# EAGLE schematic panelize (EAGLE 9.5.1)
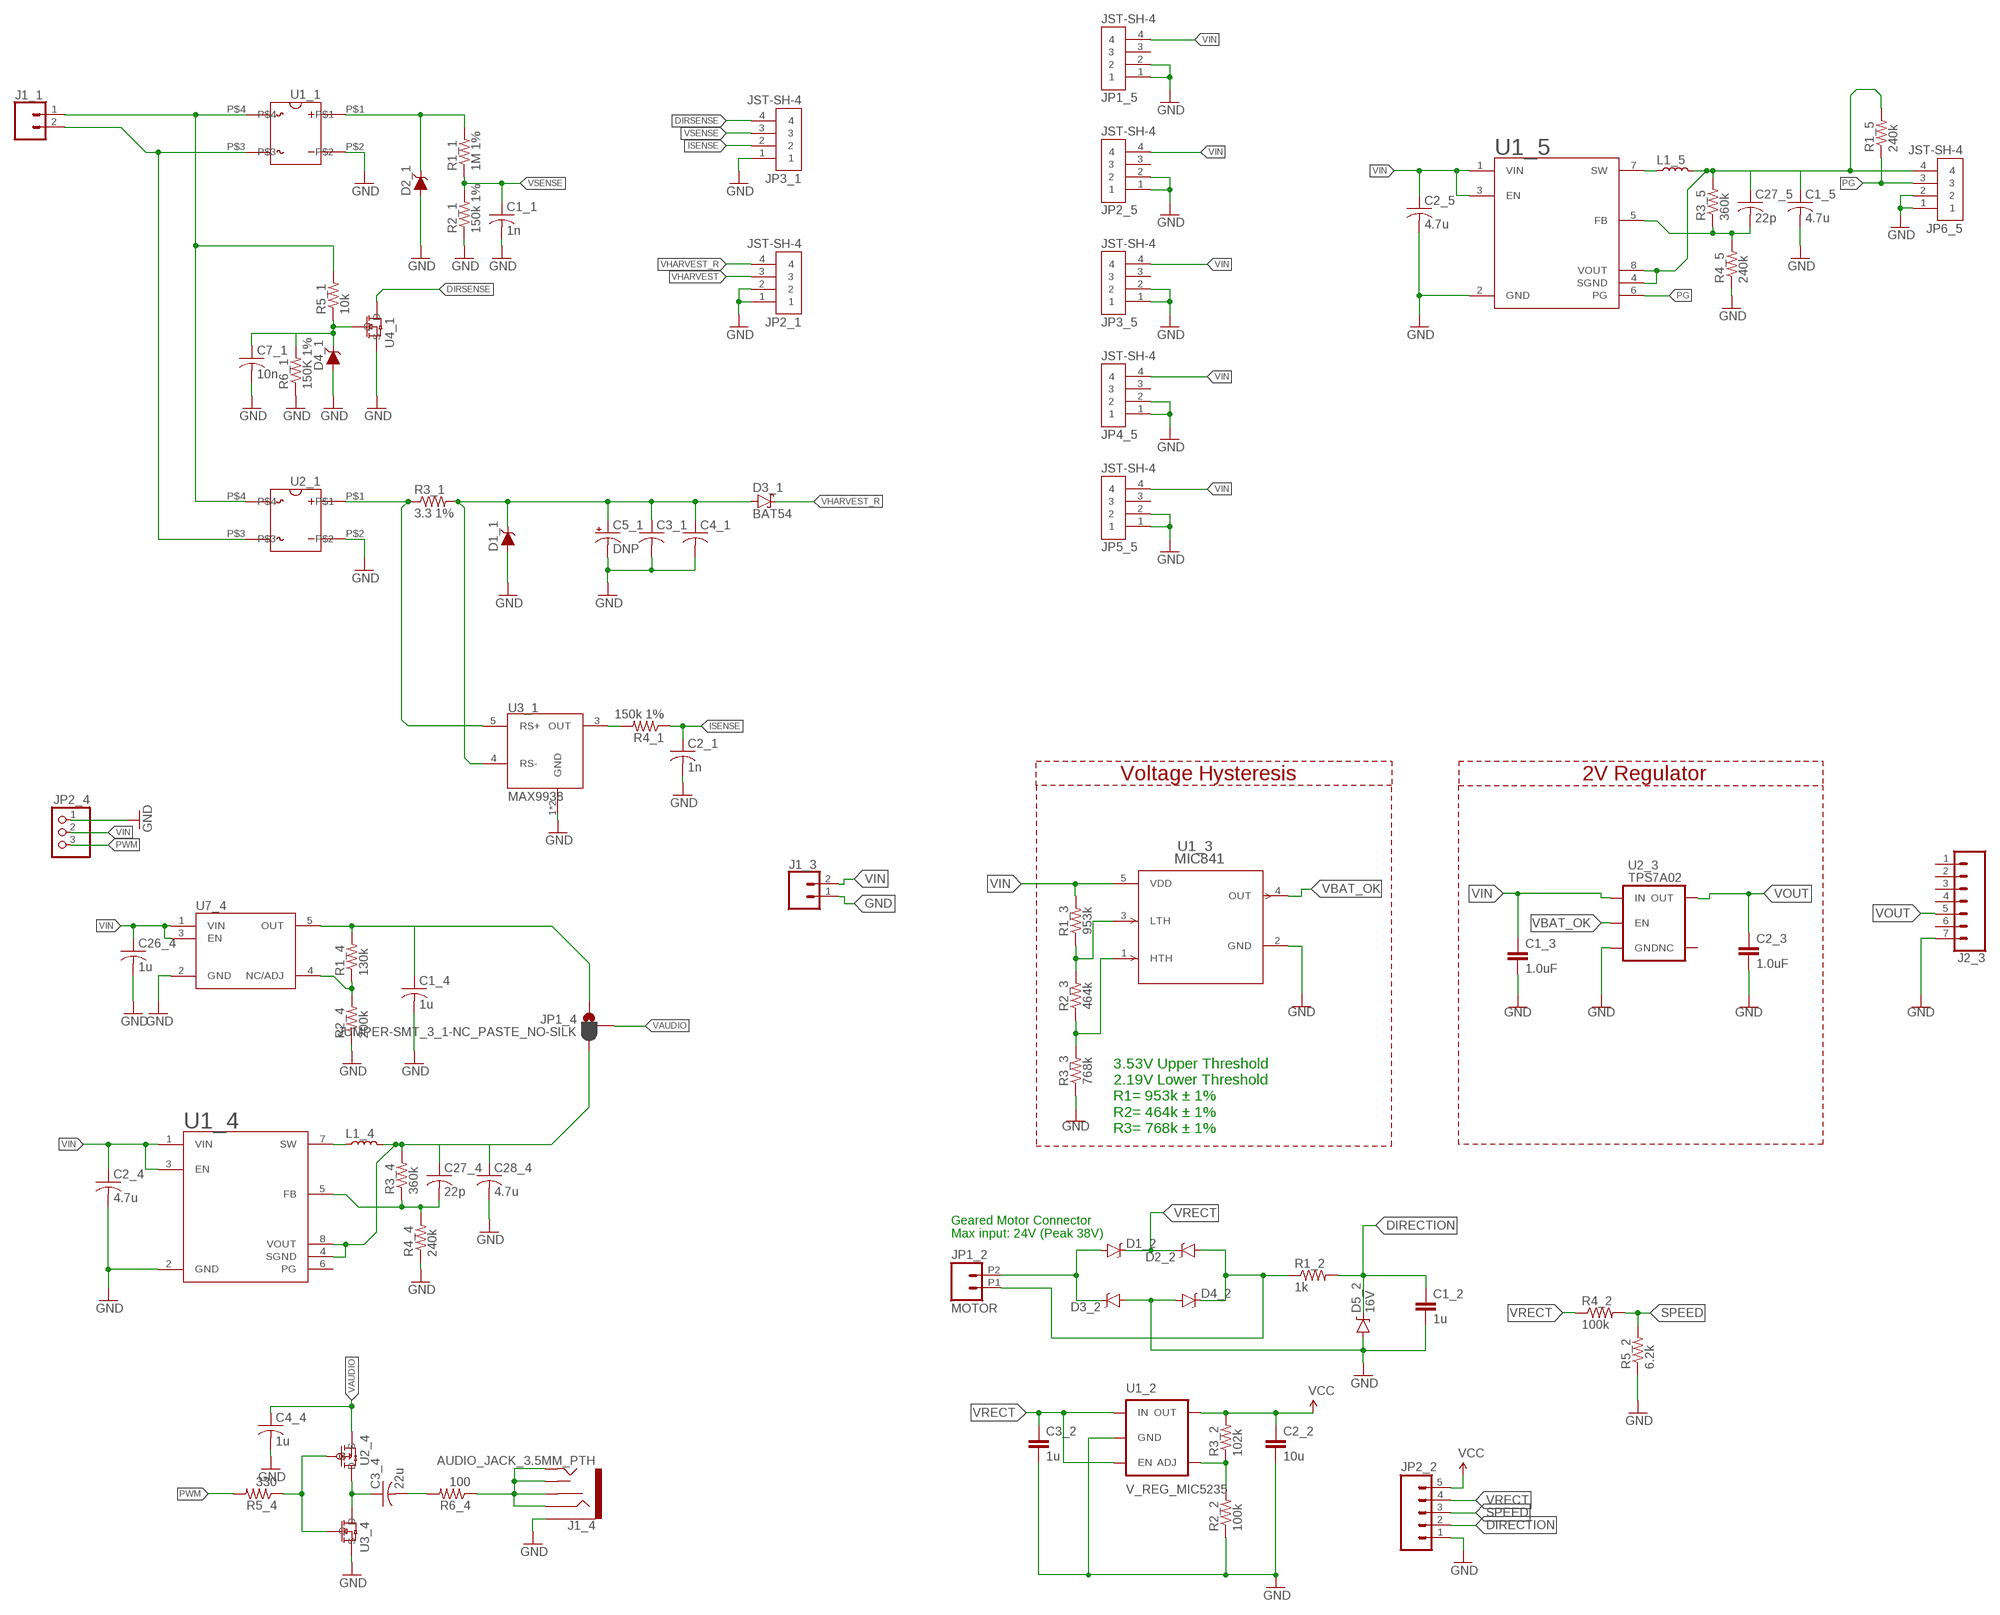
[diagram p0: schematic, sheet 1]

## Parts
C1_1  1n  C-USC0402  [C0402]
C1_2  1u  CAP0805  [0805]
C1_3  1.0uF  1.0UF-0603-16V-10%  [0603]
C1_4  1u  C-USC0603  [C0603]
C1_5  4.7u  C-USC0603  [C0603]
C2_1  1n  C-USC0402  [C0402]
C2_2  10u  CAP0805  [0805]
C2_3  1.0uF  1.0UF-0603-16V-10%  [0603]
C2_4  4.7u  C-USC0603  [C0603]
C2_5  4.7u  C-USC0603  [C0603]
C3_1  C-USC1206  [C1206]
C3_2  1u  CAP0805  [0805]
C3_4  22u  C-USC0805  [C0805]
C4_1  C-USC1206  [C1206]
C4_4  1u  C-USC0603  [C0603]
C5_1  DNP  CPOL-USE2.5-5  [E2,5-5]
C7_1  10n  C-USC0402  [C0402]
C26_4  1u  C-USC0603  [C0603]
C27_4  22p  C-USC0402  [C0402]
C27_5  22p  C-USC0402  [C0402]
C28_4  4.7u  C-USC0603  [C0603]
D1_1  3.3V  DIODE-ZENER-MM3Z3V3T1G  [SOD-323]
D1_2  BAT20JFILM  [SOD-323]
D2_1  3.3V  DIODE-ZENER-MM3Z3V3T1G  [SOD-323]
D2_2  BAT20JFILM  [SOD-323]
D3_1  BAT54  [SOT23]
D3_2  BAT20JFILM  [SOD-323]
D4_1  3.3V  DIODE-ZENER-MM3Z3V3T1G  [SOD-323]
D4_2  BAT20JFILM  [SOD-323]
D5_2  16V  DIODE-ZENER16V  [SOD-123]
J1_1  CONN_02-JST-2MM-SMT  [JST-2-SMD]
J1_3  CONN_02  [1X02]
J1_4  AUDIO_JACK_3.5MM_PTH  [AUDIO-JACK]
J2_3  CONN_07  [1X07]
JP1_2  MOTOR  M022.54MM_SCREWTERM  [1X02_2.54_SCREWTERM@1]
JP1_4  JUMPER-SMT_3_1-NC_PASTE_NO-SILK  [SMT-JUMPER_3_1-NC_PASTE_NO-SILK]
JP1_5  JST-SH-4  [JST-SH-4]
JP2_1  JST-SH-4  [JST-SH-4]
JP2_2  M05LOCK  [1X05_LOCK]
JP2_4  PINHD-1X3  [1X03]
JP2_5  JST-SH-4  [JST-SH-4]
JP3_1  JST-SH-4  [JST-SH-4]
JP3_5  JST-SH-4  [JST-SH-4]
JP4_5  JST-SH-4  [JST-SH-4]
JP5_5  JST-SH-4  [JST-SH-4]
JP6_5  JST-SH-4  [JST-SH-4]
L1_4  22u  LQH3NPN220MMEL  [LQH3NPNXXXXMEX]
L1_5  22u  LQH3NPN220MMEL  [LQH3NPNXXXXMEX]
R1_1  1M 1%  R-US_R0402  [R0402]
R1_2  1k  RESISTOR0805-RES  [0805]
R1_3  953k  RESISTOR0603  [0603]
R1_4  130k  R-US_R0603  [R0603]
R1_5  240k  R-US_R0603  [R0603]
R2_1  150k 1%  R-US_R0402  [R0402]
R2_2  100k  RESISTOR0805-RES  [0805]
R2_3  464k  RESISTOR0603  [0603]
R2_4  200k  R-US_R0603  [R0603]
R3_1  3.3 1%  R-US_R0603  [R0603]
R3_2  102k  RESISTOR0805-RES  [0805]
R3_3  768k  RESISTOR0603  [0603]
R3_4  360k  R-US_R0603  [R0603]
R3_5  360k  R-US_R0603  [R0603]
R4_1  150k 1%  R-US_R0402  [R0402]
R4_2  100k  RESISTOR0805-RES  [0805]
R4_4  240k  R-US_R0603  [R0603]
R4_5  240k  R-US_R0603  [R0603]
R5_1  10k  R-US_R0402  [R0402]
R5_2  6.2k  RESISTOR0805-RES  [0805]
R5_4  330  R-US_R0603  [R0603]
R6_1  150K 1%  R-US_R0402  [R0402]
R6_4  100  R-US_R0603  [R0603]
U1_1  CDBHD140L-G  [CDBHDXX0L-G]
U1_2  V_REG_MIC5235  [SOT23-5]
U1_3  MIC841  MIC841HYC5-TR  [SC-70_C5_MCH]
U1_4  TPS62120  [SOP65P280X145-8N]
U1_5  TPS62120  [SOP65P280X145-8N]
U2_1  CDBHD140L-G  [CDBHDXX0L-G]
U2_3  TPS7A02  [SOT23-5]
U2_4  TP2104K1-G  [TP2104K1-G]
U3_1  MAX9938  [SOT23-5]
U3_4  TN2106K1-G  [TN2106K1-G]
U4_1  TN2106K1-G  [TN2106K1-G]
U7_4  MIC5225  [MIC5225]

## Nets
BUCK_OUT: C27_4.1 C28_4.1 JP1_4.3 L1_4.P$2 R3_4.2 U1_4.4(SGND) U1_4.8(VOUT)
BUCK_OUT1: C1_5.1 C27_5.1 JP6_5.4 L1_5.P$2 R1_5.2 R3_5.2 U1_5.4(SGND) U1_5.8(VOUT)
DIRECTION: C1_2.1 D5_2.C JP2_2.2 R1_2.2
DIRSENSE: JP3_1.4 U4_1.D
GND: C1_1.2 C1_2.2 C1_3.2 C1_4.2 C1_5.2 C2_1.2 C2_2.2 C2_3.2 C2_4.2 C2_5.2 C3_1.2 C3_2.2 C4_1.2 C4_4.2 C5_1.- C7_1.2 C26_4.2 C28_4.2 D1_1.A D2_1.A D3_2.A D4_1.A D4_2.A D5_2.A J1_3.1 J1_4.SLEEVE J2_3.7 JP1_5.1 JP1_5.2 JP2_1.1 JP2_1.2 JP2_2.1 JP2_4.1 JP2_5.1 JP2_5.2 JP3_1.1 JP3_5.1 JP3_5.2 JP4_5.1 JP4_5.2 JP5_5.1 JP5_5.2 JP6_5.1 JP6_5.2 R2_1.1 R2_2.1 R2_4.1 R3_3.1 R4_4.1 R4_5.1 R5_2.1 R6_1.1 U1_1.P$2 U1_2.2(GND) U1_3.2(GND) U1_4.2(GND) U1_5.2(GND) U2_1.P$2 U2_3.2(GND) U3_1.1(GND) U3_1.2(GND) U3_4.S U4_1.S U7_4.2(GND)
ISENSE: C2_1.1 JP3_1.2 R4_1.1
LINEAR_OUT: C1_4.1 JP1_4.1 R1_4.2 U7_4.5(OUT)
N$1: R2_2.2 R3_2.1 U1_2.4(ADJ)
N$2: C27_4.2 R3_4.1 R4_4.2 U1_4.5(FB)
N$3: D1_2.A D3_2.C JP1_2.P2
N$4: D2_2.A D4_2.C JP1_2.P1 R1_2.1
N$5: L1_4.P$1 U1_4.7(SW)
N$6: R1_4.1 R2_4.2 U7_4.4(NC/ADJ)
N$7: R1_3.1 R2_3.2 U1_3.3(LTH)
N$8: R2_3.1 R3_3.2 U1_3.1(HTH)
N$9: R5_4.1 U2_4.G U3_4.G
N$10: C3_4.1 U2_4.D U3_4.D
N$11: C3_4.2 R6_4.2
N$12: J1_4.RING J1_4.RSH J1_4.TIP J1_4.TSH R6_4.1
N$13: J1_1.1 R5_1.2 U1_1.P$4 U2_1.P$4
N$14: J1_1.2 U1_1.P$3 U2_1.P$3
N$15: D2_1.C R1_1.2 U1_1.P$1
N$16: R3_1.1 U2_1.P$1 U3_1.5(RS+)
N$17: R4_1.2 U3_1.3(OUT)
N$18: C7_1.1 D4_1.C R5_1.1 R6_1.2 U4_1.G
N$19: C27_5.2 R3_5.1 R4_5.2 U1_5.5(FB)
N$20: L1_5.P$1 U1_5.7(SW)
PG: JP6_5.3 R1_5.1 U1_5.6(PG)
PWM: JP2_4.3 R5_4.2
SPEED: JP2_2.3 R4_2.2 R5_2.2
VAUDIO: C4_4.1 JP1_4.2 U2_4.S
VBAT_OK: U1_3.4(OUT) U2_3.3(EN)
VCC: C2_2.1 JP2_2.5 R3_2.2 U1_2.5(OUT)
VHARVEST: C3_1.1 C4_1.1 C5_1.+ D1_1.C D3_1.1(A) JP2_1.3 R3_1.2 U3_1.4(RS-)
VHARVEST_R: D3_1.3(C) JP2_1.4
VIN: C1_3.1 C2_4.1 C2_5.1 C26_4.1 J1_3.2 JP1_5.4 JP2_4.2 JP2_5.4 JP3_5.4 JP4_5.4 JP5_5.4 R1_3.2 U1_3.5(VDD) U1_4.1(VIN) U1_4.3(EN) U1_5.1(VIN) U1_5.3(EN) U2_3.1(IN) U7_4.1(VIN) U7_4.3(EN)
VOUT: C2_3.1 J2_3.5 U2_3.5(OUT)
VRECT: C3_2.1 D1_2.C D2_2.C JP2_2.4 R4_2.1 U1_2.1(IN) U1_2.3(EN)
VSENSE: C1_1.1 JP3_1.3 R1_1.1 R2_1.2
Unconnected: J2_3.1 J2_3.2 J2_3.3 J2_3.4 J2_3.6 JP1_5.3 JP2_5.3 JP3_5.3 JP4_5.3 JP5_5.3 U1_4.6(PG) U2_3.4(NC)

## Notes on the sheet
- Voltage Hysteresis | 2V Regulator
- 3.53V Upper Threshold 
  2.19V Lower Threshold
  R1= 953k ± 1%
  R2= 464k ± 1%
  R3= 768k ± 1%
- Geared Motor Connector
  Max input: 24V (Peak 38V)

## Library data of the parts
C1_1 C2_1 = rcl:C-US: CAPACITOR, American symbol; MFR: SAMSUNG; MFR_PN: CL05B102KB5NNNC; SPICEPREFIX: C
C1_2 C3_2 = SparkFun-Passives:CAP: Capacitor Standard 0603 ceramic capacitor, and 0.1" leaded capacitor.; MFR_PN: CL21B105KBFNNNG
C1_3 C2_3 = SparkFun-Capacitors:1.0UF: 1µF ceramic capacitors A capacitor is a passive two-terminal electrical component used to store electrical energy temporarily in an electric field.; MFR: SAMSUNG; MFR_PN: CL10B105KA8NNNC; PROD_ID: CAP-00868
C1_4 C4_4 C26_4 = rcl:C-US: CAPACITOR, American symbol; MFR: SAMSUNG; MFR_PN: CL10B105KA8NNNC; SPICEPREFIX: C
C1_5 C2_4 C2_5 C28_4 = rcl:C-US: CAPACITOR, American symbol; MFR: SAMSUNG; MFR_PN: CL10A475KA8NQNC; SPICEPREFIX: C
C2_2 = SparkFun-Passives:CAP: Capacitor Standard 0603 ceramic capacitor, and 0.1" leaded capacitor.; MFR_PN: CL21A106KPCLQNC
C3_1 C4_1 = rcl:C-US: CAPACITOR, American symbol; MFR: TDK; MFR_PN: C3216X5R1E476M160AC; SPICEPREFIX: C
C3_4 = rcl:C-US: CAPACITOR, American symbol; MFR: MURATA; MFR_PN: GRM21BR61E226ME44L; SPICEPREFIX: C
C5_1 = rcl:CPOL-US: POLARIZED CAPACITOR, American symbol; SPICEPREFIX: C
C7_1 = rcl:C-US: CAPACITOR, American symbol; MFR: SAMSUNG; MFR_PN: CL05B103KB5NNNC; SPICEPREFIX: C
C27_4 C27_5 = rcl:C-US: CAPACITOR, American symbol; MFR: KEMET; MFR_PN: C0603C220J5GACTU; SPICEPREFIX: C
D1_1 D2_1 = SparkFun-DiscreteSemi:DIODE-ZENER: Zener Diode; MFR: DIODES_INCORPORATED; MFR_PN: BZT52C15S-7-F; PROD_ID: DIO-11284
D1_2 D2_2 D3_2 D4_2 = SparkFun-DiscreteSemi:BAT20JFILM: 23V, 1A Schottky diode, SOD-323 package; MFR_PN: 1727-3877-1-ND; PROD_ID: DIO-11623; VALUE: BAT20JFILM
D3_1 = diode:BAT54: Schottky Diodes Source: Fairchild .. BAT54.pdf; MFR: ON; MFR_PN: BAT54
D4_1 = SparkFun-DiscreteSemi:DIODE-ZENER: Zener Diode; MFR: DIODES_INCORPORATED; MFR_PN: BZT52C3V3S-7-F; PROD_ID: DIO-11284
D5_2 = SparkFun-DiscreteSemi:DIODE-ZENER: Zener Diode; MFR_PN: 1727-3600-1-ND; PROD_ID: DIO-12440
J1_1 = SparkFun-Connectors:CONN_02: Multi connection point. Often used as Generic Header-pin footprint for 0.1 inch spaced/style header connections On any of the 0.1 inch spaced packages, you can populate with these: Break Away Headers - Straight <https://www.sparkfun.com/products/116> (PRT-00116) Break Away Male Headers - Right Angle <https://www.sparkfun.com/products/553> (PRT-00553) Female Headers <https://www.sparkfun.com/products/115> (PRT-00115) Break Away Headers - Machine Pin <https://www.sparkfun.com/products/117> (PRT-00117) Break Away Female Headers - Swiss Machine Pin <https://www.sparkfun.com/products/743> (PRT-00743) For SCREWTERMINALS and SPRING TERMINALS visit here: Screw Terimnals on SparkFun.com <https://www.sparkfun.com/search/results?term=Screw+Terminals> (5mm/3.5mm/2.54mm spacing) This device is also useful as a general connection point to wire up your design to another part of your project. Our various solder wires solder well into these plated through hole pads. Hook-Up Wire - Assortment (Stranded, 22 AWG) <https://www.sparkfun.com/products/11375> (PRT-11375) Hook-Up Wire - Assortment (Solid Core, 22 AWG) <https://www.sparkfun.com/products/11367> (PRT-11367) View the entire wire category on our website here <https://www.sparkfun.com/categories/141> Special notes: Molex polarized connector foot print use with: PRT-08233 with associated crimp pins and housings. 2.54_SCREWTERM for use with PRT-10571. 3.5mm Screw Terminal footprints for PRT-08084 5mm Screw Terminal footprints for use with PRT-08432; MFR: JST; MFR_PN: S2B-PH-SM4-TB(LF)(SN); PROD_ID: CONN-11443
J1_3 = SparkFun-Connectors:CONN_02: Multi connection point. Often used as Generic Header-pin footprint for 0.1 inch spaced/style header connections On any of the 0.1 inch spaced packages, you can populate with these: Break Away Headers - Straight <https://www.sparkfun.com/products/116> (PRT-00116) Break Away Male Headers - Right Angle <https://www.sparkfun.com/products/553> (PRT-00553) Female Headers <https://www.sparkfun.com/products/115> (PRT-00115) Break Away Headers - Machine Pin <https://www.sparkfun.com/products/117> (PRT-00117) Break Away Female Headers - Swiss Machine Pin <https://www.sparkfun.com/products/743> (PRT-00743) For SCREWTERMINALS and SPRING TERMINALS visit here: Screw Terimnals on SparkFun.com <https://www.sparkfun.com/search/results?term=Screw+Terminals> (5mm/3.5mm/2.54mm spacing) This device is also useful as a general connection point to wire up your design to another part of your project. Our various solder wires solder well into these plated through hole pads. Hook-Up Wire - Assortment (Stranded, 22 AWG) <https://www.sparkfun.com/products/11375> (PRT-11375) Hook-Up Wire - Assortment (Solid Core, 22 AWG) <https://www.sparkfun.com/products/11367> (PRT-11367) View the entire wire category on our website here <https://www.sparkfun.com/categories/141> Special notes: Molex polarized connector foot print use with: PRT-08233 with associated crimp pins and housings. 2.54_SCREWTERM for use with PRT-10571. 3.5mm Screw Terminal footprints for PRT-08084 5mm Screw Terminal footprints for use with PRT-08432; MFR: DNP; MFR_PN: DNP
J1_4 = SparkFun-Connectors:AUDIO_JACK_3.5MM: Audio Jack 3.5mm variants of PTH and SMT stereo audio jack with bypass switches. SparkFun Products: SparkFun SparkPunk Sound Kit <[https://www.sparkfun.com/products/11177]> - PTH MP3 Trigger <https://www.sparkfun.com/products/13720> -3.5mm SMD SparkFun PicoBoard <https://www.sparkfun.com/products/11888>- 2.5mm SMD; MFR: DNP; MFR_PN: DNP; PROD_ID: CONN-08774; SF_ID: PRT-08032
J2_3 = SparkFun-Connectors:CONN_07: Multi connection point. Often used as Generic Header-pin footprint for 0.1 inch spaced/style header connections On any of the 0.1 inch spaced packages, you can populate with these: Break Away Headers - Straight <https://www.sparkfun.com/products/116> (PRT-00116) Break Away Male Headers - Right Angle <https://www.sparkfun.com/products/553> (PRT-00553) Female Headers <https://www.sparkfun.com/products/115> (PRT-00115) Break Away Headers - Machine Pin <https://www.sparkfun.com/products/117> (PRT-00117) Break Away Female Headers - Swiss Machine Pin <https://www.sparkfun.com/products/743> (PRT-00743) For SCREWTERMINALS and SPRING TERMINALS visit here: Screw Terimnals on SparkFun.com <https://www.sparkfun.com/search/results?term=Screw+Terminals> (5mm/3.5mm/2.54mm spacing) This device is also useful as a general connection point to wire up your design to another part of your project. Our various solder wires solder well into these plated through hole pads. Hook-Up Wire - Assortment (Stranded, 22 AWG) <https://www.sparkfun.com/products/11375> (PRT-11375) Hook-Up Wire - Assortment (Solid Core, 22 AWG) <https://www.sparkfun.com/products/11367> (PRT-11367) View the entire wire category on our website here <https://www.sparkfun.com/categories/141> Special notes: Molex polarized connector foot print use with SKU : PRT-08231 with associated crimp pins and housings. 1MM SMD Version SKU: PRT-10208 NOTES ON THE VARIANTS LOCK and LOCK_LONGPADS... This footprint was designed to help hold the alignment of a through-hole component (i.e. 6-pin header) while soldering it into place. You may notice that each hole has been shifted either up or down by 0.005 of an inch from it's more standard position (which is a perfectly straight line). This slight alteration caused the pins (the squares in the middle) to touch the edges of the holes. Because they are alternating, it causes a "brace" to hold the component in place. 0.005 has proven to be the perfect amount of "off-center" position when using our standard breakaway headers. Although looks a little odd when you look at the bare footprint, once you have a header in there, the alteration is very hard to notice. Also,if you push a header all the way into place, it is covered up entirely on the bottom side.; MFR: DNP; MFR_PN: DNP
JP1_2 = SparkFun-Connectors:M02: Standard 2-pin 0.1" header. Use with - straight break away headers ( PRT-00116) - right angle break away headers (PRT-00553) - swiss pins (PRT-00743) - machine pins (PRT-00117) - female headers (PRT-00115) Molex polarized connector foot print use with: PRT-08233 with associated crimp pins and housings. 2.54_SCREWTERM for use with PRT-10571. 3.5mm Screw Terminal footprints for PRT-08084 5mm Screw Terminal footprints for use with PRT-08432; MFR: DNP; MFR_PN: DNP
JP1_4 = SparkFun-Jumpers:JUMPER-SMT_3_1-NC_PASTE: Normally closed solder jumper (1 of 2 connections) This jumper has an aperture in the stencil to allow solder paste to bridge one of the two connections. One connection is normally closed (NC), while the other is normally open (NO). Wick off the solder to open the connection. Reapply solder to reclose the connection. Apply solder to the other side instead to change the current path.; MFR: DNP; MFR_PN: DNP
JP1_5 JP2_1 JP2_5 JP3_1 JP3_5 JP4_5 JP5_5 JP6_5 = jst-sh:JST-SH-4: JST-SH 4 pin connector; MFR: JST; MFR_PN: SM04B-SRSS-TB(LF)(SN)
JP2_2 = SparkFun-Connectors:M05: Header 5 Standard 5-pin 0.1" header. Use with straight break away headers (SKU : PRT-00116), right angle break away headers (PRT-00553), swiss pins (PRT-00743), machine pins (PRT-00117), and female headers (PRT-00115). Molex polarized connector foot print use with SKU : PRT-08230 with associated crimp pins and housings.; MFR: DNP; MFR_PN: DNP
JP2_4 = pinhead:PINHD-1X3: PIN HEADER; MFR: DNP; MFR_PN: DNP
L1_4 L1_5 = afig-0007:LQH3NPN220MMEL; MFR: MURATA; MFR_PN: LQH3NPN220MJRL
R1_1 = rcl:R-US_: RESISTOR, American symbol; MFR: YAGEO; MFR_PN: RC0402FR-071ML; SPICEPREFIX: R
R1_2 R5_2 = SparkFun-Passives:RESISTOR: Resistor Basic schematic elements and footprints for 0603, 1206, and PTH resistors.; MFR: YAGEO; MFR_PN: RC0805FR-076K2L
R1_3 = SparkFun-Resistors:RESISTOR: Generic Resistor Package; MFR: PANASONIC; MFR_PN: ERJ-3EKF9533V
R1_4 = rcl:R-US_: RESISTOR, American symbol; MFR: PANASONIC; MFR_PN: ERJ-3GEYJ134V; SPICEPREFIX: R
R1_5 R4_4 R4_5 = rcl:R-US_: RESISTOR, American symbol; MFR: PANASONIC; MFR_PN: ERJ-3GEYJ244V; SPICEPREFIX: R
R2_1 R4_1 R6_1 = rcl:R-US_: RESISTOR, American symbol; MFR: YAGEO; MFR_PN: RC0402FR-07150KL; SPICEPREFIX: R
R2_2 R4_2 = SparkFun-Passives:RESISTOR: Resistor Basic schematic elements and footprints for 0603, 1206, and PTH resistors.; MFR: YAGEO; MFR_PN: RC0805FR-07100KL
R2_3 = SparkFun-Resistors:RESISTOR: Generic Resistor Package; MFR: PANASONIC; MFR_PN: ERJ-3EKF4643V
R2_4 = rcl:R-US_: RESISTOR, American symbol; MFR: PANASONIC; MFR_PN: ERJ-3GEYJ204V; SPICEPREFIX: R
R3_1 = rcl:R-US_: RESISTOR, American symbol; MFR: PANASONIC; MFR_PN: ERJ-3BQF3R3V; SPICEPREFIX: R
R3_2 = SparkFun-Passives:RESISTOR: Resistor Basic schematic elements and footprints for 0603, 1206, and PTH resistors.; MFR: YAGEO; MFR_PN: RC0805FR-07102KL
R3_3 = SparkFun-Resistors:RESISTOR: Generic Resistor Package; MFR: PANASONIC; MFR_PN: ERJ-3EKF7683V
R3_4 R3_5 = rcl:R-US_: RESISTOR, American symbol; MFR: PANASONIC; MFR_PN: ERJ-3GEYJ364V; SPICEPREFIX: R
R5_1 = rcl:R-US_: RESISTOR, American symbol; MFR: YAGEO; MFR_PN: RC0402FR-0710KL; SPICEPREFIX: R
R5_4 = rcl:R-US_: RESISTOR, American symbol; MFR: YAGEO; MFR_PN: RC0603FR-07330RL; SPICEPREFIX: R
R6_4 = rcl:R-US_: RESISTOR, American symbol; MFR: YAGEO; MFR_PN: RC0603JR-07100RL; SPICEPREFIX: R
U1_1 U2_1 = afig-0007:CDBHD140L-G; MFR: COMCHIP; MFR_PN: CDBHD140L-G
U1_2 = SparkFun-PowerIC:V_REG_MIC5235; MFR_PN: 576-1284-1-ND
U1_3 = super-sensor:MIC841HYC5-TR; BUILT_BY: EMA_Jessica; COPYRIGHT: Copyright (C) 2018 Accelerated Designs. All rights reserved; MANUFACTURER_PART_NUMBER: MIC841NYC5-TR; MFR_PN: MIC841NYC5-TR; SOURCELIBRARY: Microchip_2019-08-23_3; VENDOR: Microchip
U1_4 U1_5 = afig-0007:TPS62120; MFR: TI; MFR_PN: TPS62120
U2_3 = TexasInstruments-Regulators:TPS7A02: TPS7A0220PDBVR; MFR: TI; MFR_PN: TPS7A0220PDBVR
U2_4 = tp2104:TP2104K1-G: P-Channel Enhancement-Mode Vertical DMOS FET; MFR: MICROCHIP; MFR_PN: TP2104K1-G
U3_1 = max9938:MAX9938: 1μA, 4-Bump UCSP/SOT23, Precision Current-Sense Amplifier The MAX9938 high-side current-sense amplifier offers precision accuracy specifications of VOS less than 500μV (max) and gain error less than 0.5% (max). Quiescent supply current is an ultra-low 1μA. The MAX9938 fits in a tiny, 1mm x 1mm UCSPTM package size or a 5-pin SOT23 package, making the part ideal for applications in notebook computers, cell phones, PDAs, and all battery-operated portable devices where accura- cy, low quiescent current, and small size are critical. The MAX9938 features an input common-mode voltage range from 1.6V to 28V. These current-sense amplifiers have a voltage output and are offered in four gain versions: 25V/V (MAX9938T), 50V/V (MAX9938F), 100V/V (MAX9938H), and 200V/V (MAX9938W). The four gain selections offer flexibility in the choice of the external current-sense resistor. The very low 500μV (max) input offset voltage allows small 25mV to 50mV full-scale VSENSE voltage for very low voltage drop at full-current measurement. The MAX9938 is offered in tiny 4-bump, UCSP (1mm x 1mm x 0.6mm footprint), 5-pin SOT23, and 6-pin μDFN (2mm x 2mm x 0.8mm) packages specified for operation over the -40°C to +85°C extended temperature range.; MFR: MAXIM; MFR_PN: MAX9938TEUK+T
U3_4 U4_1 = tn2106:TN2106K1-G: N-Channel Enhancement-Mode Vertical DMOS FET R_dson(max) = 2.5Ohm V_gs(th)(max) = 2V; MFR: MICROCHIP; MFR_PN: TN2106K1-G
U7_4 = afig-0007:MIC5225; MFR: MICROCHIP; MFR_PN: MIC5225YM5